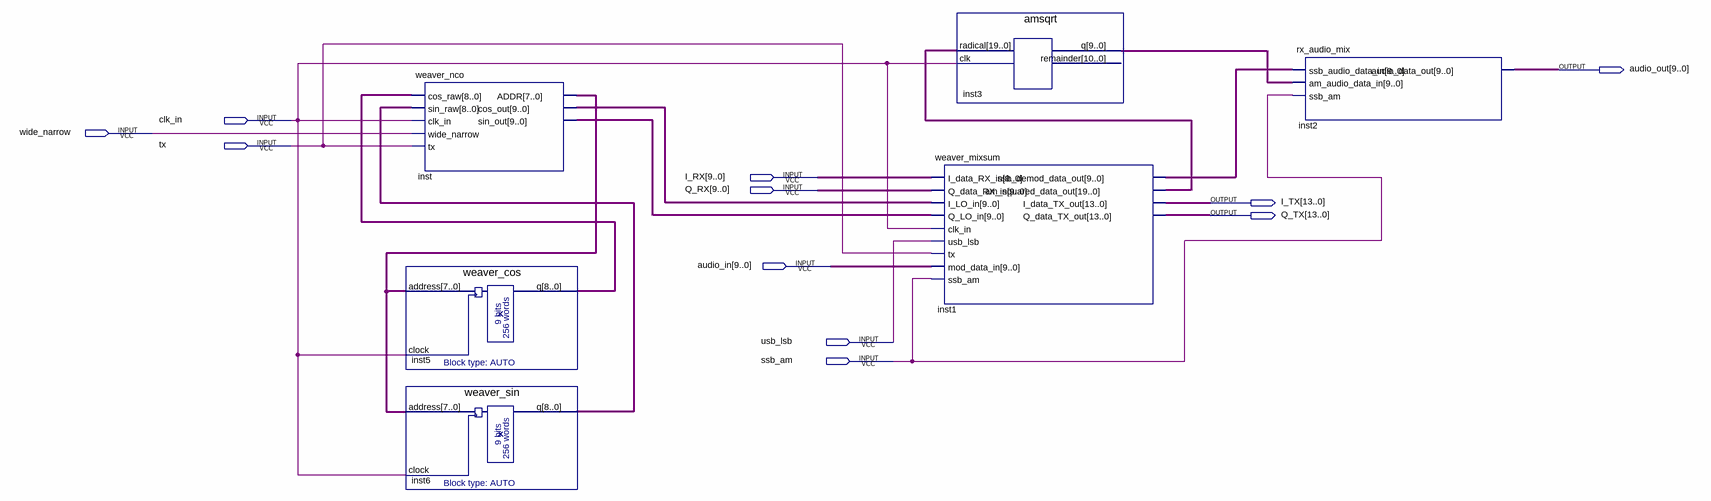
[diagram p0: schematic sheet]
// Quartus schematic moddemod.bdf as structural Verilog: 6 symbols, 11 pins
module moddemod (
  input  clk_in,
  input  wide_narrow,
  input  tx,
  input  [9:0] I_RX,
  input  [9:0] Q_RX,
  input  [9:0] audio_in,
  input  usb_lsb,
  input  ssb_am,
  output [9:0] audio_out,
  output [13:0] I_TX,
  output [13:0] Q_TX
);

  wire [7:0] inst_addr;
  wire [8:0] inst5_q, inst6_q;
  wire [9:0] inst1_ssb_demod_data_out, inst3_q, inst_cos_out, inst_sin_out;
  wire [19:0] inst1_am_squared_data_out;

  weaver_nco inst (
    .cos_raw(inst5_q), .sin_raw(inst6_q), .clk_in(clk_in), .wide_narrow(wide_narrow), .tx(tx),
    .ADDR(inst_addr), .cos_out(inst_cos_out), .sin_out(inst_sin_out));
  weaver_cos inst5 (.address(inst_addr), .clock(clk_in), .q(inst5_q));
  weaver_sin inst6 (.address(inst_addr), .clock(clk_in), .q(inst6_q));
  weaver_mixsum inst1 (
    .I_data_RX_in(I_RX), .Q_data_RX_in(Q_RX), .I_LO_in(inst_cos_out), .Q_LO_in(inst_sin_out),
    .clk_in(clk_in), .usb_lsb(usb_lsb), .tx(tx), .mod_data_in(audio_in), .ssb_am(ssb_am),
    .ssb_demod_data_out(inst1_ssb_demod_data_out), .am_squared_data_out(inst1_am_squared_data_out),
    .I_data_TX_out(I_TX), .Q_data_TX_out(Q_TX));
  amsqrt inst3 (.radical(inst1_am_squared_data_out), .clk(clk_in), .q(inst3_q));  // open: remainder
  rx_audio_mix inst2 (
    .ssb_audio_data_in(inst1_ssb_demod_data_out), .am_audio_data_in(inst3_q), .ssb_am(ssb_am),
    .audio_data_out(audio_out));
endmodule
